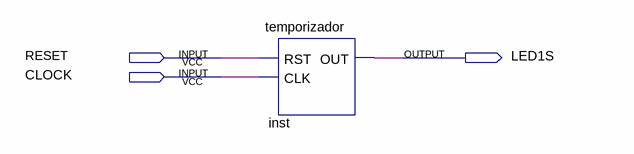
[diagram p0: schematic sheet]
// Quartus schematic Temporizador_Decimo_de_Segundo.bdf as structural Verilog: 1 symbols, 3 pins
module Temporizador_Decimo_de_Segundo (
  input  RESET,
  input  CLOCK,
  output LED1S
);

  temporizador inst (.RST(RESET), .CLK(CLOCK), .OUT(LED1S));
endmodule
